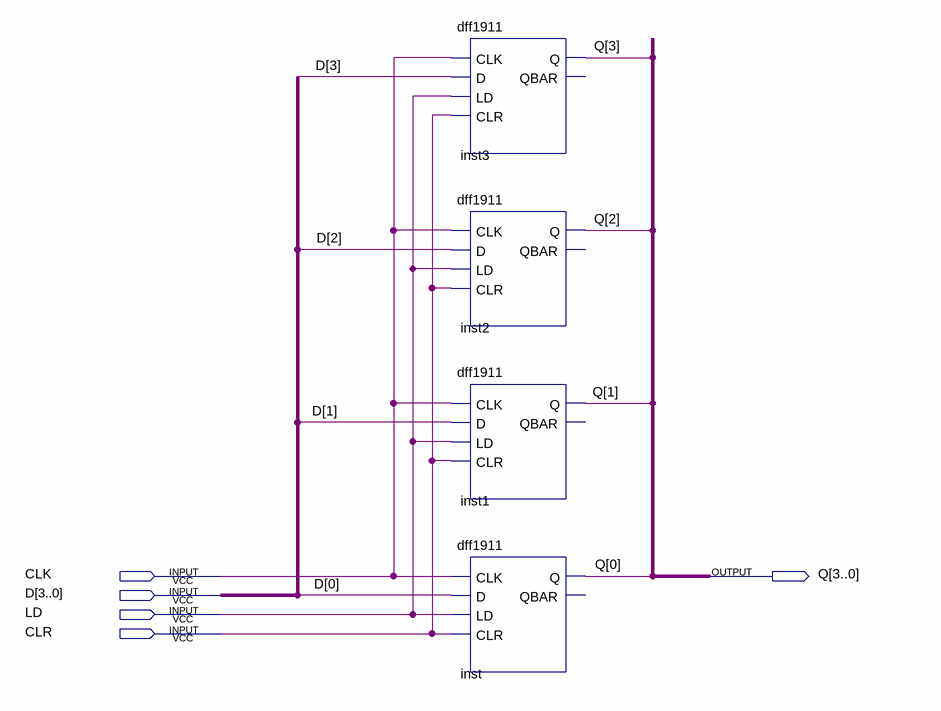
[diagram p0: schematic sheet]
// Quartus schematic reg4.bdf as structural Verilog: 4 symbols, 5 pins
module reg4 (
  input  CLK,
  input  [3:0] D,
  input  LD,
  input  CLR,
  output [3:0] Q
);

  dff1911 inst3 (.CLK(CLK), .D(D[3]), .LD(LD), .CLR(CLR), .Q(Q[3]));  // open: QBAR
  dff1911 inst2 (.CLK(CLK), .D(D[2]), .LD(LD), .CLR(CLR), .Q(Q[2]));  // open: QBAR
  dff1911 inst1 (.CLK(CLK), .D(D[1]), .LD(LD), .CLR(CLR), .Q(Q[1]));  // open: QBAR
  dff1911 inst (.CLK(CLK), .D(D[0]), .LD(LD), .CLR(CLR), .Q(Q[0]));  // open: QBAR
endmodule
